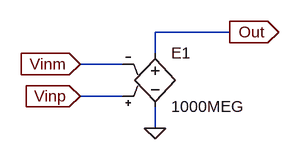
[diagram p0: schematic Ideal_op_amp.asc]
Ideal_op_amp.asc, the LTspice schematic file:
Version 4
SHEET 1 6300 692
WIRE 1424 288 1360 288
WIRE 1424 336 1360 336
WIRE 1472 272 1472 240
WIRE 1472 384 1472 352
WIRE 1584 240 1472 240
FLAG 1472 384 0
FLAG 1584 240 Out
IOPIN 1584 240 Out
FLAG 1360 288 Vinm
IOPIN 1360 288 In
FLAG 1360 336 Vinp
IOPIN 1360 336 In
SYMBOL e2 1472 256 R0
SYMATTR InstName E1
SYMATTR Value 1000MEG

The netlist it stands for:
* Ideal_op_amp.asc
E1 Out 0 Vinp Vinm 1000MEG
.backanno
.end